# Altium schematic sheet 02.MCU&Logic.SchDoc
size A3
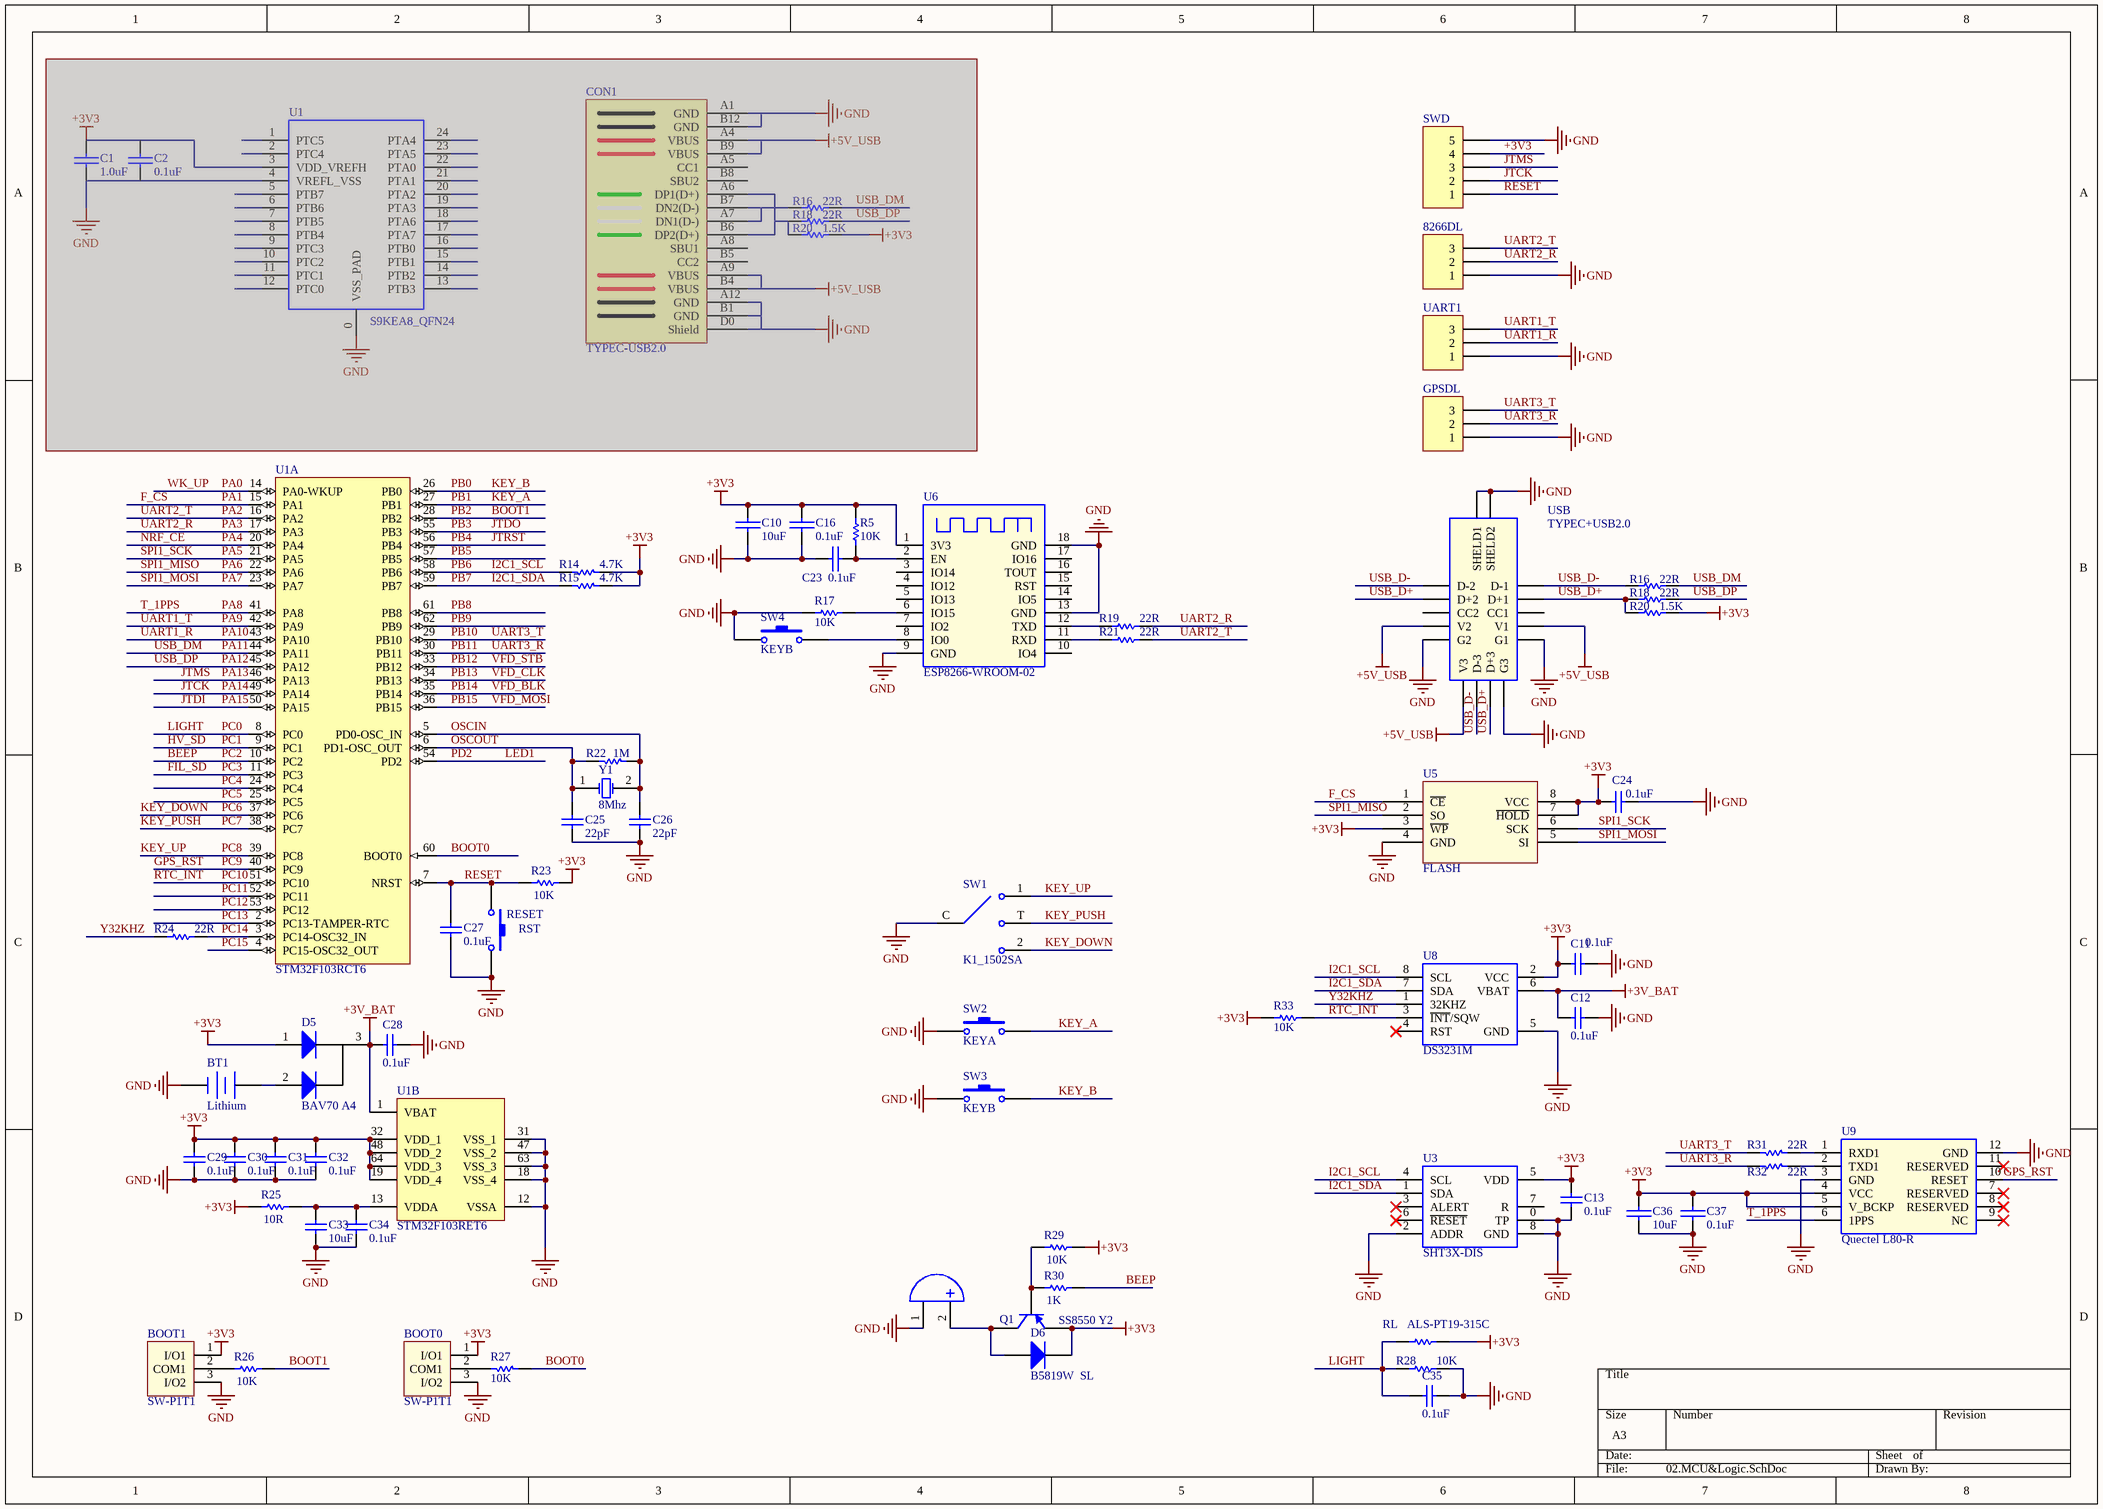
[diagram p0: 02.MCU&Logic.SchDoc]

## Parts
(Parts that share a designator on the sheet are numbered #1, #2 ... from top to bottom, then left to right.)
8266DL  MHDR1X3  [HDR1X3H]  (value not drawn)
BEEPER1  BEEPER  [BUZZ_9*5.5]  (value not drawn)
BOOT0  SW-P1T1  [SW-P1T1]
BOOT1  SW-P1T1  [SW-P1T1]
BT1  Lithium  [LI1220_1]
C1  1.0uF  [LC-0603_C]  (masked out: inside a compile mask, not in the netlist)
C2  0.1uF  [LC-0603_C]  (masked out: inside a compile mask, not in the netlist)
C10  10uF  [LC-0805_C]
C11  value 0.1uF  [LC-0603_C]  (hidden comment: Cap)
C12  value 0.1uF  [LC-0603_C]  (hidden comment: Cap)
C13  value 0.1uF  [LC-0603_C]  (hidden comment: Cap)
C16  0.1uF  [LC-0603_C]
C23  0.1uF  [LC-0603_C]
C24  value 0.1uF  [LC-0603_C]  (hidden comment: Cap)
C25  value 22pF  [LC-0603_C]  (hidden comment: Cap)
C26  value 22pF  [LC-0603_C]  (hidden comment: Cap)
C27  value 0.1uF  [LC-0603_C]  (hidden comment: Cap)
C28  value 0.1uF  [LC-0603_C]  (hidden comment: Cap)
C29  value 0.1uF  [LC-0603_C]  (hidden comment: Cap)
C30  value 0.1uF  [LC-0603_C]  (hidden comment: Cap)
C31  value 0.1uF  [LC-0603_C]  (hidden comment: Cap)
C32  value 0.1uF  [LC-0603_C]  (hidden comment: Cap)
C33  value 10uF  [LC-0603_C]  (hidden comment: Cap)
C34  value 0.1uF  [LC-0603_C]  (hidden comment: Cap)
C35  value 0.1uF  [LC-0603_C]  (hidden comment: Cap)
C36  10uF  [LC-0805_C]
C37  0.1uF  [LC-0603_C]
CON1  TYPEC-USB2.0  [TYPEC-USB2.0]  (masked out: inside a compile mask, not in the netlist)
D5  BAV70 A4  [LC-SOT-23(SOT-23-3)]
D6  B5819W  SL  [LC-SOD-123]
GPSDL  MHDR1X3  [HDR1X3H]  (value not drawn)
Q1  SS8550 Y2  [LC-SOT-23(SOT-23-3)]
R5  10K  [LC-0603_R]
R14  4.7K  [LC-0603_R]
R15  4.7K  [LC-0603_R]
R16#1  value 22R  [LC-0603_R]  (hidden comment: Res Semi)  (masked out: inside a compile mask, not in the netlist)
R16#2  value 22R  [LC-0603_R]  (hidden comment: Res Semi)
R17  10K  [LC-0603_R]
R18#1  value 22R  [LC-0603_R]  (hidden comment: Res Semi)  (masked out: inside a compile mask, not in the netlist)
R18#2  value 22R  [LC-0603_R]  (hidden comment: Res Semi)
R19  value 22R  [LC-0603_R]  (hidden comment: Res Semi)
R20#1  value 1.5K  [LC-0603_R]  (hidden comment: Res Semi)  (masked out: inside a compile mask, not in the netlist)
R20#2  value 1.5K  [LC-0603_R]  (hidden comment: Res Semi)
R21  value 22R  [LC-0603_R]  (hidden comment: Res Semi)
R22  value 1M  [LC-0603_R]  (hidden comment: Res Semi)
R23  value 10K  [LC-0603_R]  (hidden comment: Res Semi)
R24  value 22R  [LC-0603_R]  (hidden comment: Res Semi)
R25  value 10R  [LC-0603_R]  (hidden comment: Res Semi)
R26  10K  [LC-0603_R]
R27  10K  [LC-0603_R]
R28  value 10K  [LC-0603_R]  (hidden comment: Res Semi)
R29  value 10K  [LC-0603_R]  (hidden comment: Res Semi)
R30  value 1K  [LC-0603_R]  (hidden comment: Res Semi)
R31  value 22R  [LC-0603_R]  (hidden comment: Res Semi)
R32  value 22R  [LC-0603_R]  (hidden comment: Res Semi)
R33  value 10K  [LC-0603_R]  (hidden comment: Res Semi)
RESET  RST  [ALPS_SKPMA_KEY]
RL  ALS-PT19-315C  [LC-0603_R]
SW1  K1_1502SA  [K1-1502SA]
SW2  KEYA  [ALPS_SKPMA_KEY]
SW3  KEYB  [ALPS_SKPMA_KEY]
SW4  KEYB  [ALPS_SKPMA_KEY]
SWD  Header 5  [HDR1X5H]  (value not drawn)
U1#1  S9KEA8_QFN24  [LC-QFN-24_4x4x05P]  (masked out: inside a compile mask, not in the netlist)
U1#2  STM32F103RCT6  [LC-LQFP-64_10x10x05P]  (parts A,B of 2)
U3  SHT3X-DIS  [LC-DFN-8_EP_3x3mm]
U5  FLASH  [M25P32_SOP8W]
U6  ESP8266-WROOM-02  [ESP-WROOM-02]
U8  DS3231M  [LC-SOP-8_150mil]
U9  Quectel L80-R  [L80-R_GPS]
UART1  MHDR1X3  [HDR1X3H]  (value not drawn)
USB  TYPEC+USB2.0
Y1  8Mhz  [XTAL_HC-49/U]

## Nets
+3V3: BOOT0.1(I/O1) BOOT1.1(I/O1) C10.1 C11.1 C13.1 C16.1 C24.2 C29.2 C30.2 C31.2 C32.2 C36.1 C37.1 D5.1(A) D6.2(K) Q1.2(E) R5.2 R14.1 R15.1 R20#2.2 R23.2 R25.1 R29.2 R33.2 RL.2 SWD.4 U1#2.19(VDD_4) U1#2.32(VDD_1) U1#2.48(VDD_2) U1#2.64(VDD_3) U3.5(VDD) U5.3(~{WP}) U5.7(~{HOLD}) U5.8(VCC) U6.1(3V3) U8.2(VCC) U9.4(VCC) U9.5(V_BCKP)
+3V_BAT: C12.2 C28.2 D5.3(K) U1#2.1(VBAT) U8.6(VBAT)
+5V_USB: USB.V1 USB.V2 USB.V3
GND: 8266DL.1 BEEPER1.1(A) BOOT0.3(I/O2) BOOT1.3(I/O2) BT1.2(-) C10.2 C11.2 C12.1 C13.2 C16.2 C23.1 C24.1 C25.1 C26.1 C27.1 C28.1 C29.1 C30.1 C31.1 C32.1 C33.1 C34.1 C35.2 C36.2 C37.2 GPSDL.1 R17.2 R28.2 RESET.2 SW1.C SW2.1 SW3.1 SW4.1 SWD.5 U1#2.12(VSSA) U1#2.18(VSS_4) U1#2.31(VSS_1) U1#2.47(VSS_2) U1#2.63(VSS_3) U3.0(TP) U3.2(ADDR) U3.8(GND) U5.4(GND) U6.9(GND) U6.13(GND) U6.18(GND) U8.5(GND) U9.3(GND) U9.12(GND) UART1.1 USB.G1 USB.G2 USB.G3 USB.SHELD1 USB.SHELD2
BEEP: R30.2 U1#2.10(PC2)  [also labelled PC2]
BOOT0: R27.1 U1#2.60(BOOT0)
BOOT1: R26.2 U1#2.28(PB2)  [also labelled PB2]
F_CS: U1#2.15(PA1) U5.1(~{CE})  [also labelled PA1]
FIL_SD: U1#2.11(PC3)  [also labelled PC3]
GPS_RST: U1#2.40(PC9) U9.10(RESET)  [also labelled PC9]
HV_SD: U1#2.9(PC1)  [also labelled PC1]
I2C1_SCL: R14.2 U1#2.58(PB6) U3.4(SCL) U8.8(SCL)  [also labelled PB6]
I2C1_SDA: R15.2 U1#2.59(PB7) U3.1(SDA) U8.7(SDA)  [also labelled PB7]
JTCK: SWD.2 U1#2.49(PA14)  [also labelled PA14]
JTDI: U1#2.50(PA15)  [also labelled PA15]
JTDO: U1#2.55(PB3)  [also labelled PB3]
JTMS: SWD.3 U1#2.46(PA13)  [also labelled PA13]
JTRST: U1#2.56(PB4)  [also labelled PB4]
KEY_A: SW2.2 U1#2.27(PB1)  [also labelled PB1]
KEY_B: SW3.2 U1#2.26(PB0)  [also labelled PB0]
KEY_DOWN: SW1.2 U1#2.37(PC6)  [also labelled PC6]
KEY_PUSH: SW1.T U1#2.38(PC7)  [also labelled PC7]
KEY_UP: SW1.1 U1#2.39(PC8)  [also labelled PC8]
LED1: U1#2.54(PD2)  [also labelled PD2]
LIGHT: C35.1 R28.1 RL.1 U1#2.8(PC0)  [also labelled PC0]
NRF_CE: U1#2.20(PA4)  [also labelled PA4]
OSCIN: C26.2 R22.1 U1#2.5(PD0-OSC_IN) Y1.2(OSC2)
OSCOUT: C25.2 R22.2 U1#2.6(PD1-OSC_OUT) Y1.1(OSC1)
PA0: U1#2.14(PA0-WKUP)  [also labelled WK_UP]
PA2: 8266DL.3 R21.2 U1#2.16(PA2)  [also labelled UART2_T]
PA3: 8266DL.2 R19.2 U1#2.17(PA3)  [also labelled UART2_R]
PA5: U1#2.21(PA5) U5.6(SCK)  [also labelled SPI1_SCK]
PA6: U1#2.22(PA6) U5.2(SO)  [also labelled SPI1_MISO]
PA7: U1#2.23(PA7) U5.5(SI)  [also labelled SPI1_MOSI]
PA8: U1#2.41(PA8) U9.6(1PPS)  [also labelled T_1PPS]
PA9: U1#2.42(PA9) UART1.3  [also labelled UART1_T]
PA10: U1#2.43(PA10) UART1.2  [also labelled UART1_R]
PA11: R16#2.2 U1#2.44(PA11)  [also labelled USB_DM]
PA12: R18#2.2 U1#2.45(PA12)  [also labelled USB_DP]
PB5: U1#2.57(PB5)
PB8: U1#2.61(PB8)
PB9: U1#2.62(PB9)
PB10: GPSDL.3 R31.2 U1#2.29(PB10)  [also labelled UART3_T]
PB11: GPSDL.2 R32.2 U1#2.30(PB11)  [also labelled UART3_R]
PB12: U1#2.33(PB12)  [also labelled VFD_STB]
PB13: U1#2.34(PB13)  [also labelled VFD_CLK]
PB14: U1#2.35(PB14)  [also labelled VFD_BLK]
PB15: U1#2.36(PB15)  [also labelled VFD_MOSI]
PC4: U1#2.24(PC4)
PC5: U1#2.25(PC5)
PC10: R33.1 U1#2.51(PC10) U8.3(~{INT}/SQW)  [also labelled RTC_INT]
PC11: U1#2.52(PC11)
PC12: U1#2.53(PC12)
PC13: U1#2.2(PC13-TAMPER-RTC)
PC14: R24.2 U1#2.3(PC14-OSC32_IN)
PC15: U1#2.4(PC15-OSC32_OUT)
RESET: C27.2 R23.1 RESET.1 SWD.1 U1#2.7(NRST)
USB_D+: R18#2.1 R20#2.1 USB.D+1 USB.D+2 USB.D+3
USB_D-: R16#2.1 USB.D-1 USB.D-2 USB.D-3
Y32KHZ: R24.1 U8.1(32KHZ)
NetBEEPER1_2: BEEPER1.2(B) D6.1(A) Q1.3(C)
NetBOOT0_2: BOOT0.2(COM1) R27.2
NetBOOT1_2: BOOT1.2(COM1) R26.1
NetBT1_1: BT1.1(+) D5.2(A)
NetC23_2: C23.2 R5.1 U6.2(EN)
NetC33_2: C33.2 C34.2 R25.2 U1#2.13(VDDA)
NetQ1_1: Q1.1(B) R29.1 R30.1
NetR17_1: R17.1 U6.6(IO15)
NetR19_1: R19.1 U6.12(TXD)
NetR21_1: R21.1 U6.11(RXD)
NetR31_1: R31.1 U9.1(RXD1)
NetR32_1: R32.1 U9.2(TXD1)
NetSW4_2: SW4.2 U6.8(IO0)

Not connected (* = marked no-connect by the designer): U3 3(ALERT)* 6(~{RESET})* 7(R); U6 3(IO14) 4(IO12) 5(IO13) 7(IO2) 10(IO4) 14(IO5) 15(RST) 16(TOUT) 17(IO16); U8 4(RST)*; U9 7(RESERVED)* 8(RESERVED)* 9(NC)* 11(RESERVED)*; USB CC1 CC2

## Library data of the parts
8266DL GPSDL UART1 = MHDR1X3: Header, 3-Pin; LatestRevisionDate: 17-Jul-2002; LatestRevisionNote: Re-released for DXP Platform.; Publisher: Altium Limited
BEEPER1 = Bell: Electrical Bell; Published: 24-Mar-1999; LatestRevisionDate: 17-Jul-2002; LatestRevisionNote: Re-released for DXP Platform.; Publisher: Altium Limited
BT1 = Battery: Multicell Battery; Published: 24-Mar-1999; LatestRevisionDate: 17-Jul-2002; LatestRevisionNote: Re-released for DXP Platform.; PackageReference: BAT-2; Publisher: Altium Limited; PackageDescription: Battery; 2 Leads
C1 C2 C10 C16 C23 C36 C37 = CAP: Capacitor
C11-C13 C24-C35 = Cap: Capacitor; Published: 8-Jun-2000; LatestRevisionDate: 17-Jul-2002; LatestRevisionNote: Re-released for DXP Platform.; PackageReference: RAD-0.3; Publisher: Altium Limited; PackageDescription: Radial Cap, Thru-Hole; 2 Leads; 0.3 in Pin Spacing
D5 = SOT-23 BAV70 A4: 开关二极管; ComponentLink1Description: 供应商链接; ComponentLink1URL: http://www.szlcsc.com/product/details_70091.html; Package: SOT-23; Supplier: LC; SuppliersPartNumber: C68978
D6 = SOD-123 B5819W  SL: 肖特基二极管; ComponentLink1Description: 供应商链接; ComponentLink1URL: http://www.szlcsc.com/product/details_9093.html; Package: SOD-123; Supplier: LC; SuppliersPartNumber: C8598
Q1 = SOT-23 SS8550 Y2: 三极管; ComponentLink1Description: 供应商链接; ComponentLink1URL: http://www.szlcsc.com/product/details_9037.html; Package: SOT-23; Supplier: LC; SuppliersPartNumber: C8542
R5 R17 = Res Semi: Semiconductor Resistor; Value: 100R; Published: 8-Jun-2000; LatestRevisionDate: 17-Jul-2002; LatestRevisionNote: Re-released for DXP Platform.; PackageReference: AXIAL-0.5; Publisher: Altium Limited; PackageDescription: Axial Device, Thru-Hole; 2 Leads; 0.5 in Pin Spacing
R14 R15 = Res Semi: Semiconductor Resistor; Value: 10K; Published: 8-Jun-2000; LatestRevisionDate: 17-Jul-2002; LatestRevisionNote: Re-released for DXP Platform.; PackageReference: AXIAL-0.5; Publisher: Altium Limited; PackageDescription: Axial Device, Thru-Hole; 2 Leads; 0.5 in Pin Spacing
R16#1 R16#2 R18#1 R18#2 R19 R20#1 R20#2 R21-R33 = Res Semi: Semiconductor Resistor; Published: 8-Jun-2000; LatestRevisionDate: 17-Jul-2002; LatestRevisionNote: Re-released for DXP Platform.; PackageReference: AXIAL-0.5; Publisher: Altium Limited; PackageDescription: Axial Device, Thru-Hole; 2 Leads; 0.5 in Pin Spacing
  R26 R27: Value: 10K
RESET SW2-SW4 = SW-PB: Switch; Published: 24-Mar-1999; LatestRevisionDate: 17-Jul-2002; LatestRevisionNote: Re-released for DXP Platform.; PackageReference: SPST-2; Publisher: Altium Limited; PackageDescription: Switch; 2 Leads
RL = Res Semi: Semiconductor Resistor; Value: 22R; Published: 8-Jun-2000; LatestRevisionDate: 17-Jul-2002; LatestRevisionNote: Re-released for DXP Platform.; PackageReference: AXIAL-0.5; Publisher: Altium Limited; PackageDescription: Axial Device, Thru-Hole; 2 Leads; 0.5 in Pin Spacing
SW1 = SW_K1_1502SA
SWD = Header 5: Header, 5-Pin; LatestRevisionDate: 17-Jul-2002; LatestRevisionNote: Re-released for DXP Platform.; Publisher: Altium Limited
U1#2 = STM32F103RET6: ARM Cortex-M3 32-bit MCU, 512 KB Flash, 64 KB Internal RAM, 51 I/Os, 64-pin LQFP, -40 to 85 degC, Tray; A/D Converter: 3x12-bit (16 Channel); D/A Converter: 2x12-bit (2 Channel); FLASH Size (Prog) (kB): 512; I/Os (High Current): 51; Internal RAM Size (kB): 64; Operating Frequency(F) (Processor speed) (MHz): 72; Supply Voltage(Vcc) min (V): 2; DatasheetVersion: Rev. 8; PackageVersion: Rev. 4, 06/2013; PackageReference: LQFP64; PackageDescription: 64-Pin Low Profile Quad Flat Package, 10 x 10 mm Body, 0.5 mm Pitch; Supplier 1: Digi-Key; Supplier Part Number 1: 497-6444-ND; Supplier 2: Farnell; Supplier Part Number 2: 1624138; Supplier 3: Newark; Supplier Part Number 3: 01P4101; Supplier 4: Newark; Supplier Part Number 4: 57P1231; Supplier 5: Mouser; Supplier Part Number 5: 511-STM32F103RET6; Core: ARM Cortex-M3; Packing: Tray; Mounting Technology: Surface Mount; PartNumber: STM32F103RET6; ComponentLink1Description: Manufacturer URL; ComponentLink1URL: http://www.st.com/web/en/home.html; ComponentLink2Description: Datasheet; ComponentLink2URL: http://www.st.com/st-web-ui/static/active/en/resource/technical/document/datasheet/CD00191185.pdf; ComponentLink3Description: Package Specification; ComponentLink3URL: http://www.st.com/st-web-ui/static/active/en/resource/technical/document/datasheet/DM00037051.pdf
U8 = RTC_DS3231M
U9 = GPS_L80-R
USB = Type-C-L
Y1 = XTAL: Crystal Oscillator; Published: 8-Jun-2000; LatestRevisionDate: 17-Jul-2002; LatestRevisionNote: Re-released for DXP Platform.; PackageReference: R38; Publisher: Altium Limited; PackageDescription: Crystal, Thru-Hole; 2 Leads; Body 3.1 x 8.2 mm (Dia.xH)